# Altium schematic sheet Crystal_oscillator.SchDoc
size A; SheetNumber: 5; SheetTotal: 10
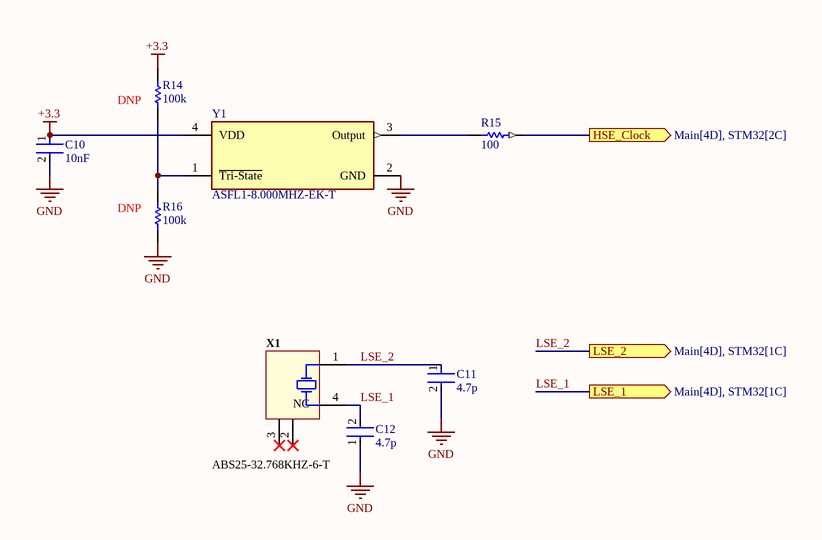
[diagram p0: Crystal_oscillator.SchDoc]

## Parts
C10  10nF  [FP-0805-L_2_01_0_2-W_1_25-IPC_B]
C11  4.7p  [FP-C0603C-CF-MFG]
C12  4.7p  [FP-C0603C-CF-MFG]
R14  100k  [RESC2013X50X30LL20T20]
R15  100  [RESC2013X50X30LL20T20]
R16  100k  [RESC2013X50X30LL20T20]
X1  ABS25-32.768KHZ-6-T  [ABRA-ABS25-4_V]
Y1  ASFL1-8.000MHZ-EK-T  [FP-ASFL1-MFG]

## Ports
HSE_Clock (out, see Main[4D], STM32[2C]), LSE_1 (out, see Main[4D], STM32[1C]), LSE_2 (out, see Main[4D], STM32[1C])

## Nets
+3.3: C10.1 R14.2 Y1.4(VDD)
GND: C10.2 C11.2 C12.1 R16.1 Y1.2(GND)
HSE_Clock: R15.2 ; port HSE_Clock
LSE_1: C12.2 X1.4(X2) ; port LSE_1
LSE_2: C11.1 X1.1(X1) ; port LSE_2
NetR14_1: R14.1 R16.2 Y1.1(~{Tri-State})
NetR15_1: R15.1 Y1.3(Output)

Not connected (* = marked no-connect by the designer): X1 2(NC)* 3(NC)*

## Notes on the sheet
- (near R14) DNP
- (near R16) DNP

## Library data of the parts
C10 = CMP-2007-04174-2: General Purpose Ceramic Capacitor, 0805, 10nF, 10%, X7R, 15%, 100V; Capacitance: 100nF; Packaging: Tape and Reel; Min Operating Temperature: -55°C; Dielectric Material: Ceramic; Height: 1.4mm; Voltage Rating: 100V; Termination: SMD/SMT; Case Code (Imperial): 0805; Case Code (Metric): 2012; Case/Package: 0805; Construction: Flat; Radiation Hardening: No; Series: -; Dielectric: X7R; Package Quantity: 2000; Mount: Surface Mount; Contact Plating: Tin; Voltage: 100V; Lead Free: Lead Free; Depth: 1.25mm; RoHS Compliant: Yes; Number of Pins: 2; Max Operating Temperature: 125°C; Length: 2.01mm; Voltage Rating (DC): 100V; Thickness: 0.055inch; REACH SVHC: No SVHC; Width: 0.049inch; Tolerance: 10%
C11 C12 = CMP-2006-03061-2: CAP CER 0.1UF 50V X7R 0603; Manufacturer: KEMET; Manufacturer Part Number: C0603C104K5RACTU; Tolerance: 0.1; Temperature Coefficient: 30ppm/°C; Material: Ceramic; Automotive Grade: Grade 1; Value: 0.10 μF; Temperature: -55°C to +125°C; RoHS: TRUE; Temperature Range High: +125°C; Lead Free: Yes; Octopart: https://octopart.com/c0603c104k5ractu-kemet-139244; Digikey Description: CAP CER 0.1UF 50V X7R 0603; Category: Cap; Package: C0603C-CF; ComponentLink2Description: Datasheet; Temperature Range Low: -55°C; Device Class L1: Passive Components; Voltage Rating: 50 V; Automotive: Yes; Device Class L3: Ceramic Capacitors; ComponentLink2URL: https://api.kemet.com/component-edge/download/datasheet/C0603C100J5GACAUTO.pdf; Capacitance: 0.10 μF; Device Class L2: Capacitors; Temperature Characteristic: X7R; Height: 0.87mm
R14-R16 = CMP-2001-04896-1: Manufacturer: Vishay Dale; Part Number: CRCW08050000Z0EA
X1 = CMP-2000-05036-1: Low Frequency Crystal, 32.768 KHz, 6 pF, +/- 20 ppm, -40 to 85 degC, 4-Pin SMD, RoHS, Tape and Reel; Manufacturer: Abracon; Tolerance: 20PPM; ESR: 50kOhms; Case Width: 3.8mm; Case Height: 2.5mm; Case Length: 8mm; Load Capacitance: 6pF; Operating Temperature Range: -40Cto+85C; Package Reference: ABS25; Factory Pack Quantity: 3000; Package Description: 4-Pin Surface Mount Device, Body 8 x 3.8 mm, Pitch 5.5 mm; Frequency: 32.768kHz; Termination Style: SMD/SMT; Manufacturer URL: http://www.abracon.com/; Type: LowFrequencyCrystal; Dimensions: 3.8mmWx8mmLx2.5mmH; Product Category: Crystals; Series: ABS25; RoHS: Details; Package / Case: 8mmx3.8mm; Datasheet Version: Jun-17; Brand: ABRACON; Datasheet URL: https://datasheet.ciiva.com/854/abs25-854528.pdf; Packaging: Reel; Mounting Style: SMD/SMT
Y1 = CMP-27762-013261-1: XTAL Oscillator 8MHz ±30ppm HCMOS, TTL 3.3V 4-SMD 5mm x 3.2mm; Min Supply Voltage: 2.97V; Load Capacitance: 15pF; Max Supply Voltage: 3.63V; Max Supply Current: 15mA; Radiation Hardening: No; Termination: SMD/SMT; Max Operating Temperature: 70°C; Frequency Stability: 30ppm; Series: ASFL1; Package Quantity: 1000; Mount: Surface Mount; Packaging: Tape and Reel; Length: 5mm; Case/Package: SMD/SMT; Lead Free: Lead Free; Operating Supply Voltage: 3.3V; Height: 0.051inch; Frequency: 8MHz; Number of Pins: 4; Depth: 3.2mm; Operating Frequency: 8 MHz; Width: 0.126inch; Min Operating Temperature: -20°C